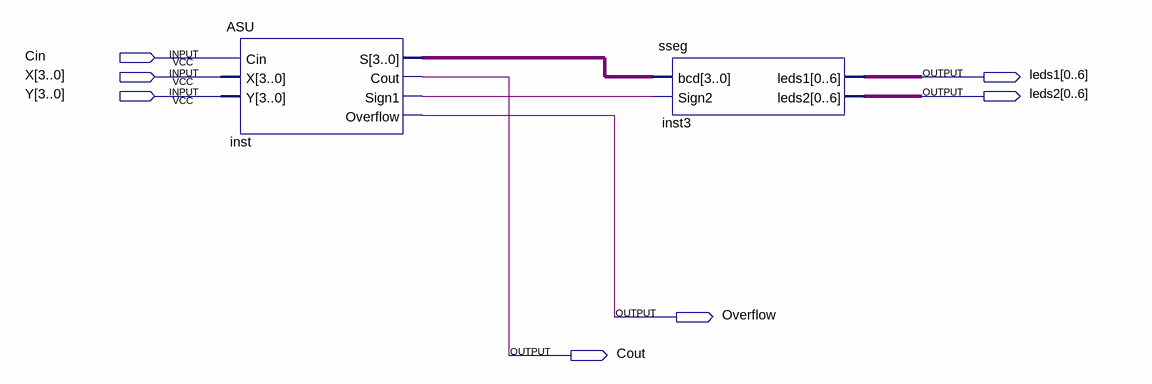
[diagram p0: schematic sheet]
// Quartus schematic CombinedASU1.bdf as structural Verilog: 2 symbols, 7 pins
module CombinedASU1 (
  input  Cin,
  input  [3:0] X,
  input  [3:0] Y,
  output [0:6] leds1,
  output [0:6] leds2,
  output Overflow,
  output Cout
);

  wire inst_sign1;
  wire [3:0] inst_s;

  ASU inst (.Cin(Cin), .X(X), .Y(Y), .S(inst_s), .Cout(Cout), .Sign1(inst_sign1), .Overflow(Overflow));
  sseg inst3 (.bcd(inst_s), .Sign2(inst_sign1), .leds1(leds1), .leds2(leds2));
endmodule
